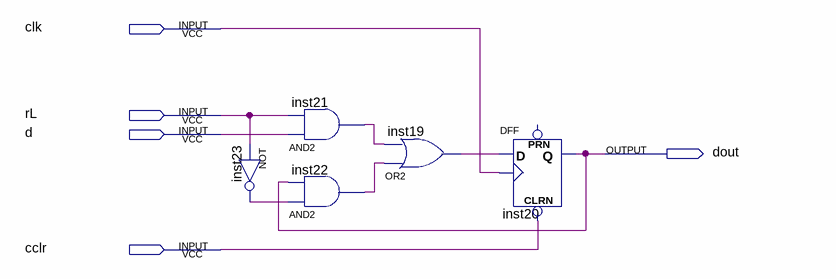
[diagram p0: schematic sheet]
// Quartus schematic r.bdf as structural Verilog: 5 symbols, 5 pins
module r (
  input  clk,
  input  rL,
  input  d,
  input  cclr,
  output dout
);

  wire inst19_out, inst21_out, inst22_out, inst23_out;

  and inst21 (inst21_out, d, rL);
  not inst23 (inst23_out, rL);
  and inst22 (inst22_out, inst23_out, dout);
  or inst19 (inst19_out, inst22_out, inst21_out);
  DFF inst20 (.CLRN(cclr), .CLK(clk), .D(inst19_out), .Q(dout));  // open: PRN
endmodule
